# EAGLE design charger (EAGLE 6.2)
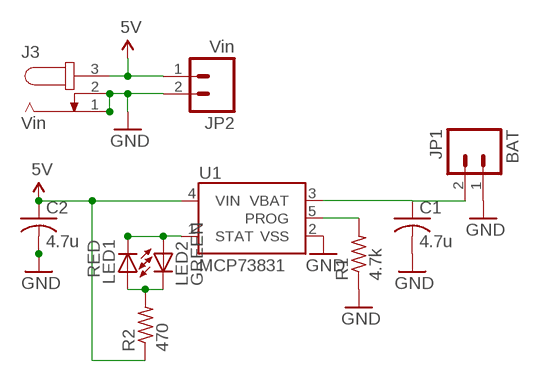
[diagram p0: schematic, sheet 1]

## Parts
C1  4.7u  C-USC0805  [C0805]
C2  4.7u  C-USC0805  [C0805]
J3  Vin  JACK-PLUG0  [SPC4077]
JP1  BAT  M02JST-PTH-2  [JST-2-PTH]
JP2  Vin  M02LOCK_LONGPADS  [1X02_LOCK_LONGPADS]
LED1  RED  LEDSML0805  [SML0805]
LED2  GREEN  LEDSML0805  [SML0805]
R1  4.7k  R-US_M1206  [M1206]
R2  470  R-US_M1206  [M1206]
U1  MCP73831  [SOT23-5]

## Nets
5V: C2.1 J3.3 JP2.1 R2.1 U1.4(VIN)
GND: C1.2 C2.2 J3.1 J3.2 JP1.1 JP2.2 R1.1 U1.2(VSS)
N$1: LED1.A LED2.C R2.2
N$2: LED1.C LED2.A U1.1(STAT)
N$4: R1.2 U1.5(PROG)
N$5: C1.1 JP1.2 U1.3(VBAT)

## Library data of the parts
C1 C2 = rcl:C-US: CAPACITOR, American symbol
J3 = con-jack:JACK-PLUG: DC POWER JACK Power Jack, DC, Right Angle, Through Hole, Rated 5A at 16VDC, PC Terminals Distributor: Farnell (www.Farnell.de) Drawing: 84N1161.pdf / 84N1162.pdf Manufacturer: SPC Technology (www.spctechnology.com) Type: SPC4077 / SPC 4078; OC_FARNELL: unknown; OC_NEWARK: unknown
JP1 JP2 = juanse:M02: Header 2 Standard 2-pin 0.1" header. Use with straight break away headers (SKU : PRT-00116), right angle break away headers (PRT-00553), swiss pins (PRT-00743), machine pins (PRT-00117), and female headers (PRT-00115). Molex polarized connector foot print use with SKU : PRT-08233 with associated crimp pins and housings.
LED1 LED2 = led:LED: LED OSRAM: - CHIPLED LG R971, LG N971, LY N971, LG Q971, LY Q971, LO R971, LY R971 LH N974, LH R974 LS Q976, LO Q976, LY Q976 LO Q996 - Hyper CHIPLED LW Q18S LB Q993, LB Q99A, LB R99A - SideLED LS A670, LO A670, LY A670, LG A670, LP A670 LB A673, LV A673, LT A673, LW A673 LH A674 LY A675 LS A676, LA A676, LO A676, LY A676, LW A676 LS A679, LY A679, LG A679 - Hyper Micro SIDELED® LS Y876, LA Y876, LO Y876, LY Y876 LT Y87S - SmartLED LW L88C, LW L88S LB L89C, LB L89S, LG L890 LS L89K, LO L89K, LY L89K LS L896, LA L896, LO L896, LY L896 - TOPLED LS T670, LO T670, LY T670, LG T670, LP T670 LSG T670, LSP T670, LSY T670, LOP T670, LYG T670 LG T671, LOG T671, LSG T671 LB T673, LV T673, LT T673, LW T673 LH T674 LS T676, LA T676, LO T676, LY T676, LB T676, LH T676, LSB T676, LW T676 LB T67C, LV T67C, LT T67C, LS T67K, LO T67K, LY T67K, LW E67C LS E67B, LA E67B, LO E67B, LY E67B, LB E67C, LV E67C, LT E67C LW T67C LS T679, LY T679, LG T679 LS T770, LO T770, LY T770, LG T770, LP T770 LB T773, LV T773, LT T773, LW T773 LH T774 LS E675, LA E675, LY E675, LS T675 LS T776, LA T776, LO T776, LY T776, LB T776 LHGB T686 LT T68C, LB T68C - Hyper Mini TOPLED® LB M676 - Mini TOPLED Santana® LG M470 LS M47K, LO M47K, LY M47K Source: http://www.osram.convergy.de LUXEON: - LUMILED® LXK2-PW12-R00, LXK2-PW12-S00, LXK2-PW14-U00, LXK2-PW14-V00 LXK2-PM12-R00, LXK2-PM12-S00, LXK2-PM14-U00 LXK2-PE12-Q00, LXK2-PE12-R00, LXK2-PE12-S00, LXK2-PE14-T00, LXK2-PE14-U00 LXK2-PB12-K00, LXK2-PB12-L00, LXK2-PB12-M00, LXK2-PB14-N00, LXK2-PB14-P00, LXK2-PB14-Q00 LXK2-PR12-L00, LXK2-PR12-M00, LXK2-PR14-Q00, LXK2-PR14-R00 LXK2-PD12-Q00, LXK2-PD12-R00, LXK2-PD12-S00 LXK2-PH12-R00, LXK2-PH12-S00 LXK2-PL12-P00, LXK2-PL12-Q00, LXK2-PL12-R00 Source: www.luxeon.com KINGBRIGHT: KA-3528ASYC Source: www.kingbright.com
R1 R2 = rcl:R-US_: RESISTOR, American symbol
U1 = SparkFun:MCP73831: Microchip's MCP73831 Miniature single cell, fully integrated Li-Ion, Li-polymer charge management controller http://ww1.microchip.com/downloads/en/DeviceDoc/21984a.pdf

## Board
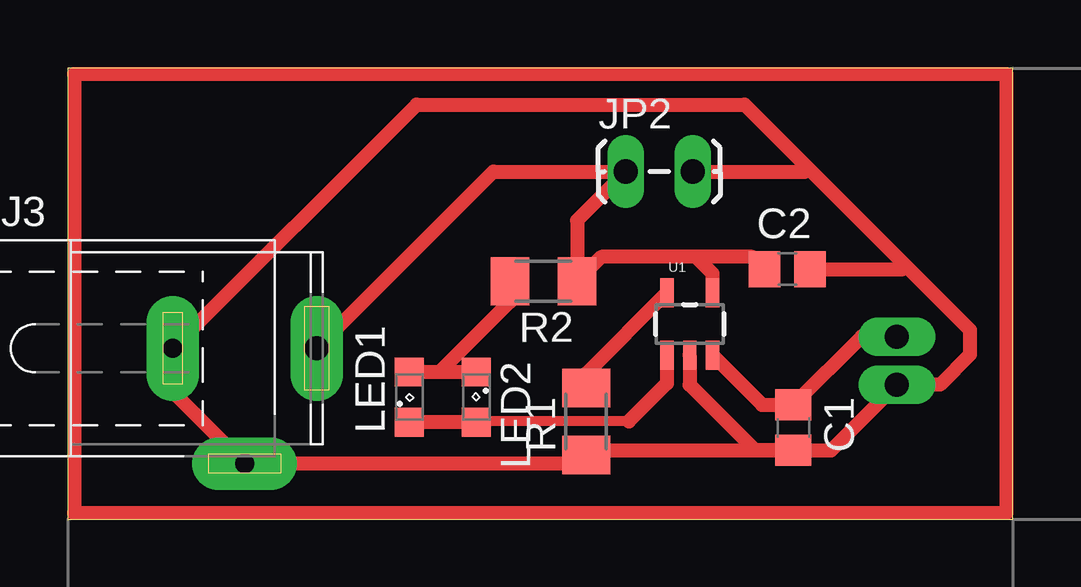
[diagram p1: board, top side]
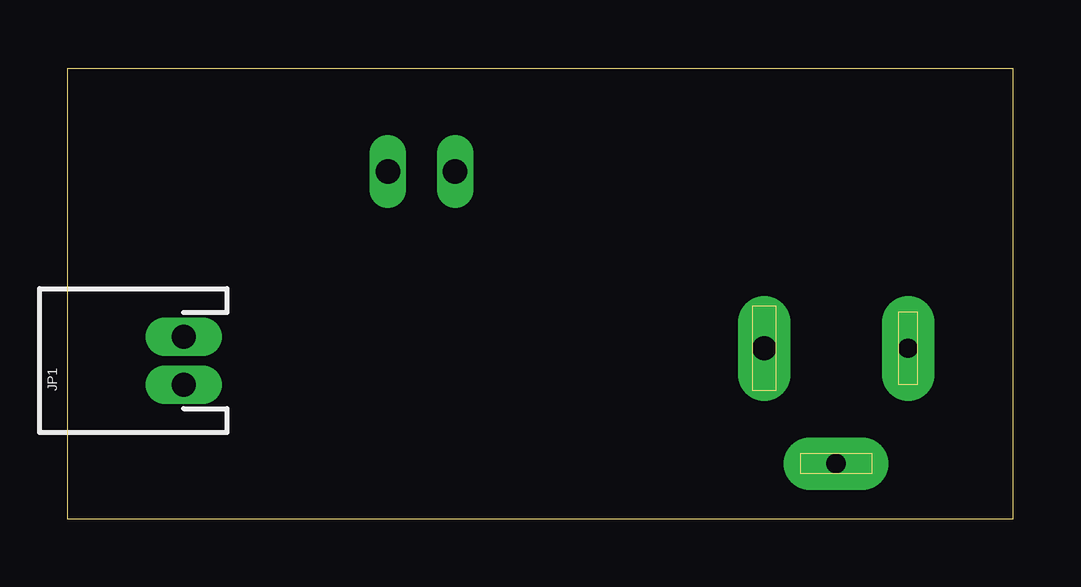
[diagram p2: board, bottom side, seen from below]

Size 39.37 x 18.79 mm. Coordinates in mm from the lower left corner, seen from the top.
Outline: 0,0 39.37,0 39.37,18.79 0,18.79 0,0
Copper layers (1*16): Top 0.035mm / dielectric 1.5mm / Bottom 0.035mm
Design rules: minimum track width 10mil, minimum drill 24mil, track to track 14mil, track to pad 14mil, pad to pad 14mil, via to via 14mil, smd to smd 14mil, copper to edge 40mil, drill to drill 8mil, minimum pad ring 10mil, minimum via ring 8mil, stop-mask expansion 4mil, vias tented up to drill 0mil, thermal gap 10mil

### Footprints (pad centres in the part's own frame; a part is rotated, then mirrored left to right if it is on the bottom)
C0805 = smd 1.3 x 1.5: 1 -0.95,0; 2 0.95,0
SPC4077 = drill 0.8 pad 2.184 long: 1 -3,0; 2 0,-4.8 | drill 1 pad 2.184 long: 3 3,0
JST-2-PTH = drill 1 pad 1.6 long: 1 -1,0; 2 1,0
1X02_LOCK_LONGPADS = drill 1.016 long: 1 -0.127,0; 2 2.667,0
SML0805 = smd 1.2 x 1.2: A 1.05,0; C -1.05,0
M1206 = smd 1.6 x 2: 1 -1.4,0; 2 1.4,0
SOT23-5 = smd 0.55 x 1.2: 1 -0.95,-1.3; 2 0,-1.3; 3 0.95,-1.3; 4 0.95,1.3; 5 -0.95,1.3

### Placement (x,y rotation side)
C1  30.23,3.81 270 top
C2  29.97,10.41 0 top
J3  7.37,7.11 0 top
JP1  34.54,6.6 90 bottom
JP2  23.37,14.48 0 top
LED1  14.22,5.08 90 top
LED2  17.02,5.08 270 top
R1  21.59,4.06 90 top
R2  19.81,9.91 180 top
U1  25.91,8.13 0 top

### Tracks (layer width: path | path; a pad name or v marks a point on that pad's centre or on a via)
5V
  Top 0.584: U1.4 26.86,10.23 26.16,10.92 | 26.16,10.92 22.23,10.92 R2.1 21.21,12.45 JP2.1 17.73,14.48 J3.3 | C2.1 28.51,10.92 26.16,10.92
GND
  Top 0.584: U1.2 25.91,5.59 28.64,2.86 21.79,2.86 | C1.2 31.8,2.86 JP1.1 36.34,5.6 37.59,6.86 37.59,7.87 34.92,10.54 | R1.1 21.24,2.31 J3.2 4.37,5.31 J3.1 14.53,17.27 28.19,17.27 30.86,14.61 | 30.86,14.61 34.92,10.54 | C2.2 34.8,10.41 34.92,10.54 | JP2.2 30.73,14.48 30.86,14.61
  Top 0.61: 28.64,2.86 C1.2 | R1.1 21.79,2.86
N$1
  Top 0.584: LED1.A 15.49,6.13 | 15.49,6.13 LED2.C | R2.2 18.41,9.05 15.49,6.13
N$2
  Top 0.406: 23.37,4.06 17.05,4.06
  Top 0.584: U1.1 24.96,5.65 23.37,4.06 | 17.05,4.06 LED2.A LED1.C
N$3
  Top 0.584: 0.25,0.25 39.12,0.25 39.12,18.54 0.25,18.54 0.25,0.25
N$4
  Top 0.584: U1.5 21.59,6.06 R1.2
N$5
  Top 0.584: U1.3 28.93,4.76 C1.1 33.07,7.6 JP1.2